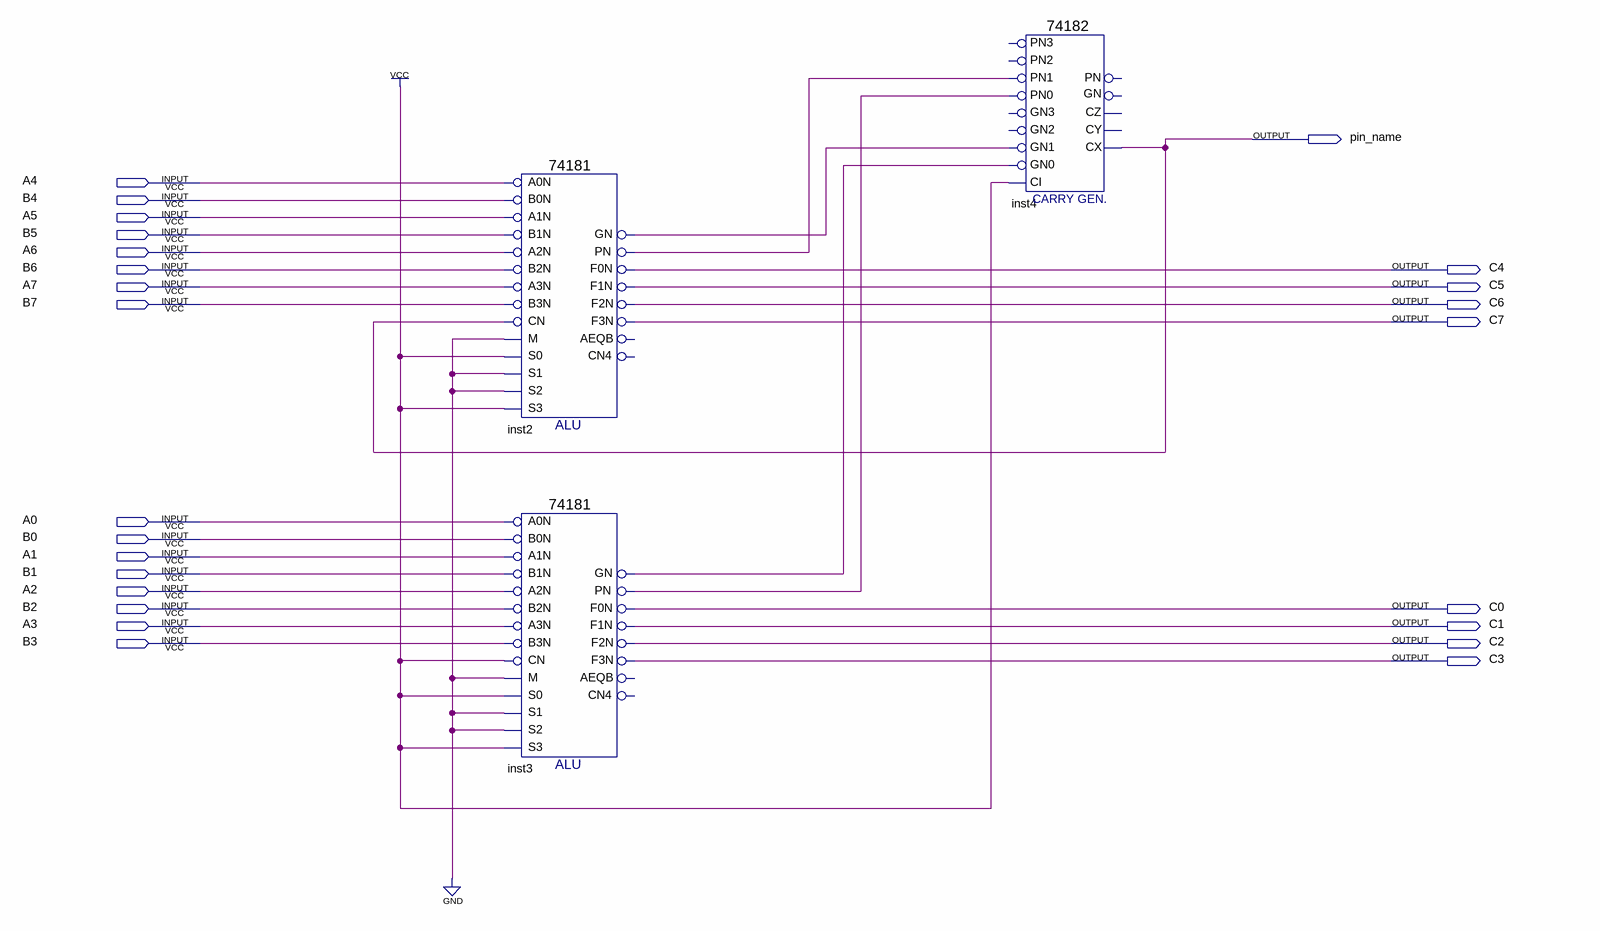
[diagram p0: schematic sheet]
// Quartus schematic ALU_8.bdf as structural Verilog: 3 symbols, 25 pins
module ALU_8 (
  input  A4,
  input  B4,
  input  A5,
  input  B5,
  input  A6,
  input  B6,
  input  A7,
  input  B7,
  input  A0,
  input  B0,
  input  A1,
  input  B1,
  input  A2,
  input  B2,
  input  A3,
  input  B3,
  output pin_name,
  output C4,
  output C5,
  output C6,
  output C7,
  output C0,
  output C1,
  output C2,
  output C3
);

  wire inst2_gn, inst2_pn, inst3_gn, inst3_pn;

  \74181  inst2 (
    .B0N(B4), .A0N(A4), .A1N(A5), .B1N(B5), .A3N(A7), .B2N(B6), .A2N(A6), .M(1'b0), .CN(pin_name), .B3N(B7),
    .S2(1'b0), .S1(1'b0), .S0(1'b1), .S3(1'b1), .PN(inst2_pn), .GN(inst2_gn), .F3N(C7), .F1N(C5), .F0N(C4),
    .F2N(C6));  // open: AEQB, CN4
  \74181  inst3 (
    .B0N(B0), .A0N(A0), .A1N(A1), .B1N(B1), .A3N(A3), .B2N(B2), .A2N(A2), .M(1'b0), .CN(1'b1), .B3N(B3),
    .S2(1'b0), .S1(1'b0), .S0(1'b1), .S3(1'b1), .PN(inst3_pn), .GN(inst3_gn), .F3N(C3), .F1N(C1), .F0N(C0),
    .F2N(C2));  // open: AEQB, CN4
  \74182  inst4 (
    .CI(1'b1), .PN1(inst2_pn), .PN0(inst3_pn), .GN1(inst2_gn), .GN0(inst3_gn), .CX(pin_name));  // open: PN2, GN2, GN3, PN3, CY, PN, CZ, GN
endmodule
